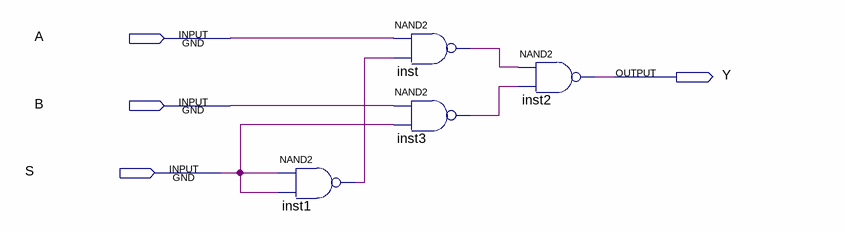
[diagram p0: schematic sheet]
// Quartus schematic Mux2p1.bdf as structural Verilog: 4 symbols, 4 pins
module Mux2p1 (
  input  A,
  input  B,
  input  S,
  output Y
);

  wire inst1_out, inst3_out, inst_out;

  nand inst1 (inst1_out, S, S);
  nand inst (inst_out, A, inst1_out);
  nand inst3 (inst3_out, B, S);
  nand inst2 (Y, inst_out, inst3_out);
endmodule
